# EAGLE schematic Laser_Harp_Arduino (EAGLE 7.6.0)
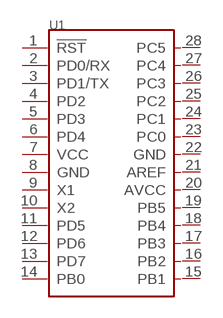
[diagram p0: schematic, sheet 1]

## Parts
U1  MCU-ATMEGA328P-PU(DIP28)  [DIP28-2.54-35.6X13.5MM]
Unconnected: U1.1(!RST) U1.2(PD0/RX) U1.3(PD1/TX) U1.4(PD2) U1.5(PD3) U1.6(PD4) U1.7(VCC) U1.8(GND) U1.9(X1) U1.10(X2) U1.11(PD5) U1.12(PD6) U1.13(PD7) U1.14(PB0) U1.15(PB1) U1.16(PB2) U1.17(PB3) U1.18(PB4) U1.19(PB5) U1.20(AVCC) U1.21(AREF) U1.22(GND) U1.23(PC0) U1.24(PC1) U1.25(PC2) U1.26(PC3) U1.27(PC4) U1.28(PC5)

## Library data of the parts
U1 = Seeed-OPL-ic:MCU-ATMEGA328P-PU(DIP28): 310010051; MPN: ATMEGA328P-PU; VALUE-DIP28: ATMEGA328P-PU